# EAGLE schematic tf1230 (EAGLE 9.6.2)

## Sheet 1 of 6
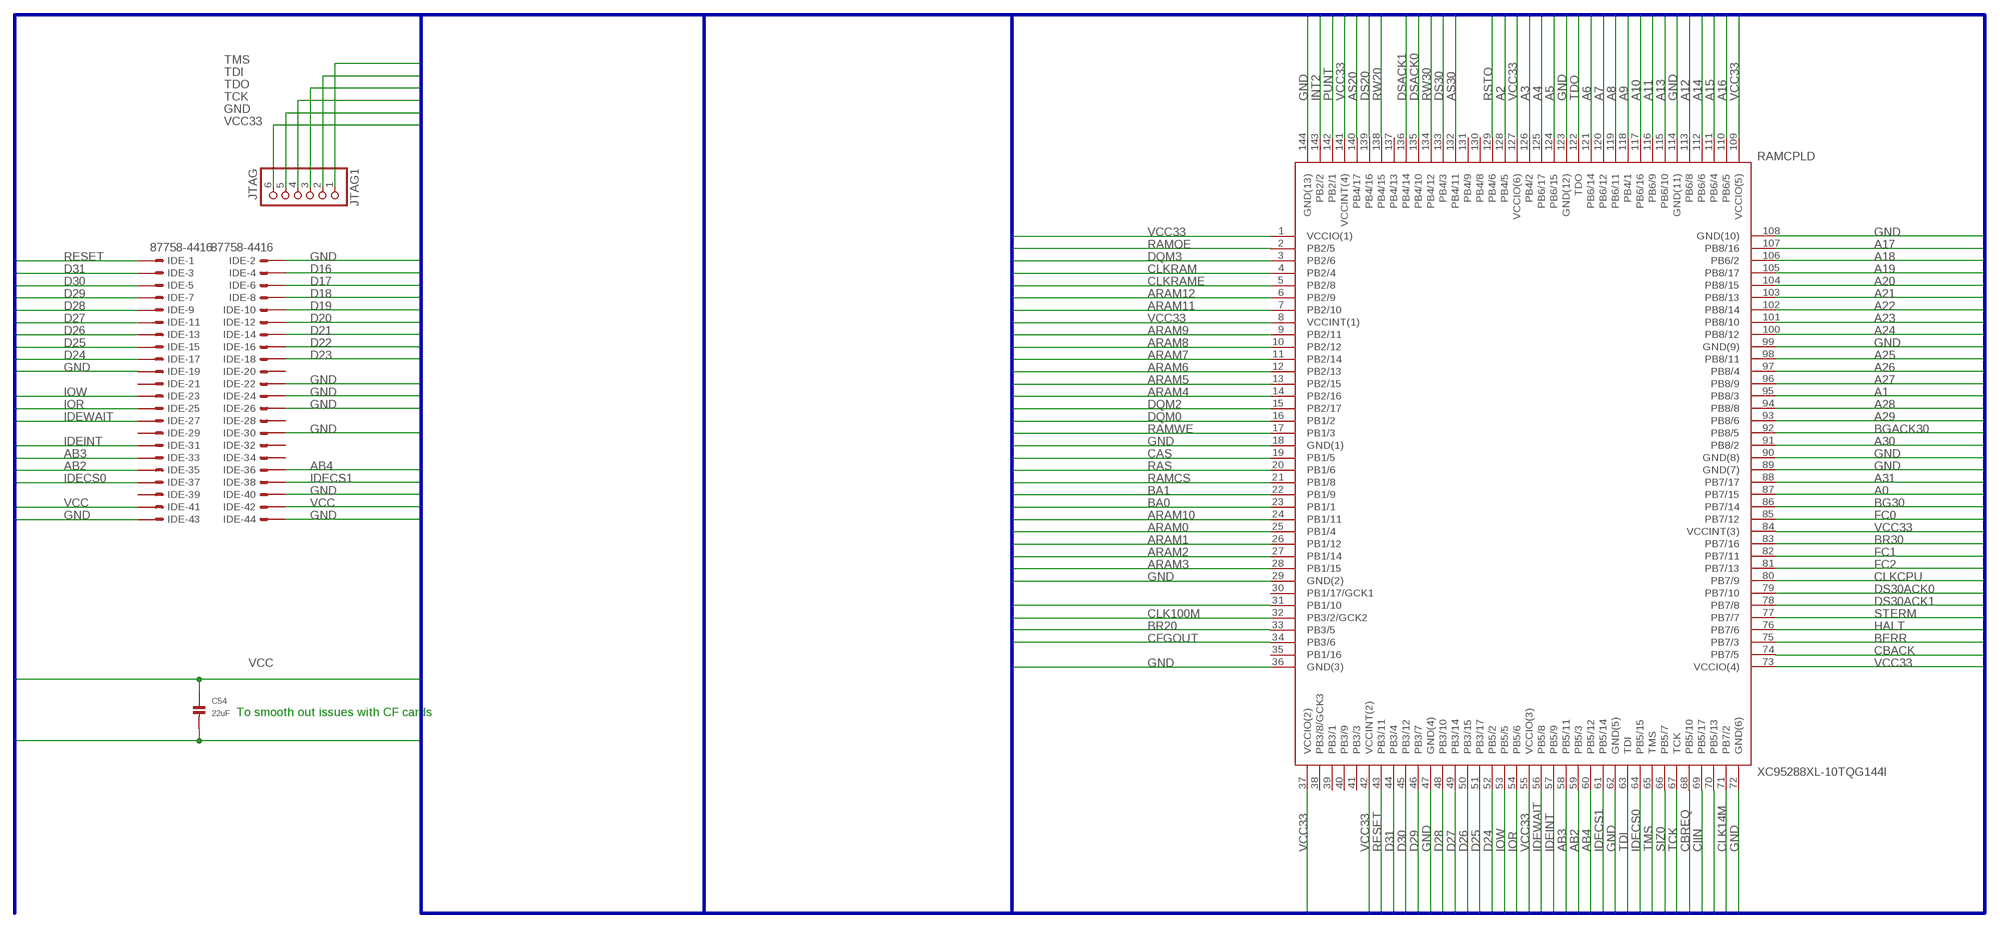
[diagram p0: schematic, sheet 1]

### Parts
C54  22uF  CAP_CERAMIC1206  [1206]
IDE  87758-4416  [87758-4416]
JTAG1  JTAG  HEADER-1X6ROUND  [1X06_ROUND]
RAMCPLD  XC95288XL-10TQG144I  SAMACSYS_PARTS_XC95144XL-10TQG144I  [SAMACSYS_PARTS_QFP50P2200X2200X160-144N]

### Nets
A0: RAMCPLD.87(PB7/15) ; also sheet 4,5
A1: RAMCPLD.95(PB8/3) ; also sheet 4,5
A2: RAMCPLD.128(PB4/5) ; also sheet 4,5
A3: RAMCPLD.126(PB4/2) ; also sheet 4,5
A4: RAMCPLD.125(PB6/17) ; also sheet 4,5
A5: RAMCPLD.124(PB6/15) ; also sheet 4,5
A6: RAMCPLD.121(PB6/14) ; also sheet 4,5
A7: RAMCPLD.120(PB6/12) ; also sheet 4,5
A8: RAMCPLD.119(PB6/11) ; also sheet 4,5
A9: RAMCPLD.118(PB4/1) ; also sheet 4,5
A10: RAMCPLD.117(PB6/16) ; also sheet 4,5
A11: RAMCPLD.116(PB6/9) ; also sheet 4,5
A12: RAMCPLD.113(PB6/8) ; also sheet 4,5
A13: RAMCPLD.115(PB6/10) ; also sheet 4,5
A14: RAMCPLD.112(PB6/6) ; also sheet 4,5
A15: RAMCPLD.111(PB6/4) ; also sheet 4,5
A16: RAMCPLD.110(PB6/5) ; also sheet 4,5
A17: RAMCPLD.107(PB8/16) ; also sheet 4,5
A18: RAMCPLD.106(PB6/2) ; also sheet 4,5
A19: RAMCPLD.105(PB8/17) ; also sheet 4,5
A20: RAMCPLD.104(PB8/15) ; also sheet 4,5
A21: RAMCPLD.103(PB8/13) ; also sheet 4,5
A22: RAMCPLD.102(PB8/14) ; also sheet 4,5
A23: RAMCPLD.101(PB8/10) ; also sheet 4,5
A24: RAMCPLD.100(PB8/12) ; also sheet 4,5
A25: RAMCPLD.98(PB8/11) ; also sheet 4,5
A26: RAMCPLD.97(PB8/4) ; also sheet 4,5
A27: RAMCPLD.96(PB8/9) ; also sheet 4,5
A28: RAMCPLD.94(PB8/8) ; also sheet 4,5
A29: RAMCPLD.93(PB8/6) ; also sheet 4,5
A30: RAMCPLD.91(PB8/2) ; also sheet 4,5
A31: RAMCPLD.88(PB7/17) ; also sheet 4,5
AB2: IDE.35 RAMCPLD.59(PB5/3)
AB3: IDE.33 RAMCPLD.58(PB5/11)
AB4: IDE.36 RAMCPLD.60(PB5/12)
ARAM0: RAMCPLD.25(PB1/4) ; also sheet 2
ARAM1: RAMCPLD.26(PB1/12) ; also sheet 2
ARAM2: RAMCPLD.27(PB1/14) ; also sheet 2
ARAM3: RAMCPLD.28(PB1/15) ; also sheet 2
ARAM4: RAMCPLD.14(PB2/16) ; also sheet 2
ARAM5: RAMCPLD.13(PB2/15) ; also sheet 2
ARAM6: RAMCPLD.12(PB2/13) ; also sheet 2
ARAM7: RAMCPLD.11(PB2/14) ; also sheet 2
ARAM8: RAMCPLD.10(PB2/12) ; also sheet 2
ARAM9: RAMCPLD.9(PB2/11) ; also sheet 2
ARAM10: RAMCPLD.24(PB1/11) ; also sheet 2
ARAM11: RAMCPLD.7(PB2/10) ; also sheet 2
ARAM12: RAMCPLD.6(PB2/9) ; also sheet 2
AS20: RAMCPLD.140(PB4/17) ; also sheet 4
AS30: RAMCPLD.132(PB4/11) ; also sheet 5
BA0: RAMCPLD.23(PB1/1) ; also sheet 2
BA1: RAMCPLD.22(PB1/9) ; also sheet 2
BERR: RAMCPLD.75(PB7/3) ; also sheet 4,5
BG30: RAMCPLD.86(PB7/14) ; also sheet 5
BGACK30: RAMCPLD.92(PB8/5) ; also sheet 5
BR20: RAMCPLD.33(PB3/5) ; also sheet 2,4,5
BR30: RAMCPLD.83(PB7/16) ; also sheet 5
CAS: RAMCPLD.19(PB1/5) ; also sheet 2
CBACK: RAMCPLD.74(PB7/5) ; also sheet 5
CBREQ: RAMCPLD.68(PB5/10) ; also sheet 5
CFGOUT: RAMCPLD.34(PB3/6) ; also sheet 4
CIIN: RAMCPLD.69(PB5/17) ; also sheet 5
CLK14M: RAMCPLD.71(PB7/2) ; also sheet 4
CLK100M: RAMCPLD.32(PB3/2/GCK2) ; also sheet 2
CLKCPU: RAMCPLD.80(PB7/9) ; also sheet 5
CLKRAM: RAMCPLD.4(PB2/4) ; also sheet 2
CLKRAME: RAMCPLD.5(PB2/8) ; also sheet 2
D16: IDE.4 ; also sheet 4,5,6
D17: IDE.6 ; also sheet 4,5,6
D18: IDE.8 ; also sheet 4,5,6
D19: IDE.10 ; also sheet 4,5,6
D20: IDE.12 ; also sheet 4,5,6
D21: IDE.14 ; also sheet 4,5,6
D22: IDE.16 ; also sheet 4,5,6
D23: IDE.18 ; also sheet 4,5,6
D24: IDE.17 RAMCPLD.52(PB5/2) ; also sheet 4,5,6
D25: IDE.15 RAMCPLD.51(PB3/17) ; also sheet 4,5,6
D26: IDE.13 RAMCPLD.50(PB3/15) ; also sheet 4,5,6
D27: IDE.11 RAMCPLD.49(PB3/14) ; also sheet 4,5,6
D28: IDE.9 RAMCPLD.48(PB3/10) ; also sheet 4,5,6
D29: IDE.7 RAMCPLD.46(PB3/7) ; also sheet 4,5,6
D30: IDE.5 RAMCPLD.45(PB3/12) ; also sheet 4,5,6
D31: IDE.3 RAMCPLD.44(PB3/4) ; also sheet 4,5,6
DQM0: RAMCPLD.16(PB1/2) ; also sheet 2
DQM1: RAMCPLD.31(PB1/10) ; also sheet 2
DQM2: RAMCPLD.15(PB2/17) ; also sheet 2
DQM3: RAMCPLD.3(PB2/6) ; also sheet 2
DS20: RAMCPLD.139(PB4/16) ; also sheet 4
DS30: RAMCPLD.133(PB4/3) ; also sheet 5
DS30ACK0: RAMCPLD.79(PB7/10) ; also sheet 5
DS30ACK1: RAMCPLD.78(PB7/8) ; also sheet 5
DSACK0: RAMCPLD.135(PB4/10) ; also sheet 4
DSACK1: RAMCPLD.136(PB4/14) ; also sheet 4
FC0: RAMCPLD.85(PB7/12) ; also sheet 4,5
FC1: RAMCPLD.82(PB7/11) ; also sheet 4,5
FC2: RAMCPLD.81(PB7/13) ; also sheet 4,5
GND: C54.2 IDE.2 IDE.19 IDE.22 IDE.24 IDE.26 IDE.30 IDE.40 IDE.43 IDE.44 JTAG1.5 RAMCPLD.18(GND(1)) RAMCPLD.29(GND(2)) RAMCPLD.36(GND(3)) RAMCPLD.47(GND(4)) RAMCPLD.62(GND(5)) RAMCPLD.72(GND(6)) RAMCPLD.89(GND(7)) RAMCPLD.90(GND(8)) RAMCPLD.99(GND(9)) RAMCPLD.108(GND(10)) RAMCPLD.114(GND(11)) RAMCPLD.123(GND(12)) RAMCPLD.144(GND(13)) ; also sheet 2,3,4,5,6
HALT: RAMCPLD.76(PB7/6) ; also sheet 5
IDECS0: IDE.37 RAMCPLD.64(PB5/15)
IDECS1: IDE.38 RAMCPLD.61(PB5/14)
IDEINT: IDE.31 RAMCPLD.57(PB5/9) ; also sheet 5
IDEWAIT: IDE.27 RAMCPLD.56(PB5/8) ; also sheet 5
INT2: RAMCPLD.143(PB2/2) ; also sheet 4
IOR: IDE.25 RAMCPLD.54(PB5/6)
IOW: IDE.23 RAMCPLD.53(PB5/5)
PUNT: RAMCPLD.142(PB2/1) ; also sheet 4
RAMCS: RAMCPLD.21(PB1/8) ; also sheet 2
RAMOE: RAMCPLD.2(PB2/5) ; also sheet 6
RAMWE: RAMCPLD.17(PB1/3) ; also sheet 2
RAS: RAMCPLD.20(PB1/6) ; also sheet 2
RESET: IDE.1 RAMCPLD.43(PB3/11) ; also sheet 4
RSTO: RAMCPLD.129(PB4/6) ; also sheet 5
RW20: RAMCPLD.138(PB4/15) ; also sheet 4
RW30: RAMCPLD.134(PB4/12) ; also sheet 5
SIZ0: RAMCPLD.66(PB5/7) ; also sheet 4,5
SIZ1: RAMCPLD.70(PB5/13) ; also sheet 4,5
STERM: RAMCPLD.77(PB7/7) ; also sheet 5
TCK: JTAG1.4 RAMCPLD.67(TCK)
TDI: JTAG1.2 RAMCPLD.63(TDI)
TDO: JTAG1.3 RAMCPLD.122(TDO)
TMS: JTAG1.1 RAMCPLD.65(TMS)
VCC: C54.1 IDE.41 IDE.42 ; also sheet 2,3,4,5
VCC33: JTAG1.6 RAMCPLD.1(VCCIO(1)) RAMCPLD.8(VCCINT(1)) RAMCPLD.37(VCCIO(2)) RAMCPLD.42(VCCINT(2)) RAMCPLD.55(VCCIO(3)) RAMCPLD.73(VCCIO(4)) RAMCPLD.84(VCCINT(3)) RAMCPLD.109(VCCIO(5)) RAMCPLD.127(VCCIO(6)) RAMCPLD.141(VCCINT(4)) ; also sheet 2,3,6
Unconnected: IDE.20 IDE.21 IDE.28 IDE.29 IDE.32 IDE.34 IDE.39 RAMCPLD.30(PB1/17/GCK1) RAMCPLD.35(PB1/16) RAMCPLD.38(PB3/8/GCK3) RAMCPLD.39(PB3/1) RAMCPLD.40(PB3/9) RAMCPLD.41(PB3/3) RAMCPLD.130(PB4/8) RAMCPLD.131(PB4/9) RAMCPLD.137(PB4/13)

### Buses
A[0..31],AA[0..31],AB[0..5],ACTIVE,AGND,AMIGA_IPL[0..2],AMIGA_RST,ARAM[0..12],AS20,AS30,AUX[0..2],AVEC,AVEC60,BA[0..1],BB60,BCLK,BERR,BG30,BG60,BGACK30,BR20,BR30,BR60,BUSEN,CAS,CBACK,CBREQ,CDIS,CFGIN,CFGOUT,CIIN,CIIOUT,CLA,CLK14M,CLK50M,CLK100M,CLK100M_ALT,CLK100M_N,CLKCPU,CLKEN,CLKRAM,CLKRAME,CLKSEL[0..2],CLKSEL_[0..2],CPUSPACE,D[0..31],DBEN,DD[0..31],DQ[0..31],DQM[0..3],DS20,DS30,DS30ACK[0..1],DSACK[0..1],E,EXP_BG,EXP_BR,FAN_ON,FAN_RPM,FC[0..2],FIRE[0..1],GND,HALT,IDECS[0..1],IDEINT,IDELED,IDEWAIT,INT2,INT6,INTCYCLE,INTSIG[0..1],IOR,IOW,IPL[0..2],LOCK,LOCKE,MMUDIS,PCLK,PUNT,RAMCS,RAMOE,RAMWE,RAS,REFILL,RESET,RESET_O,_RST,RSTO,RTC_CS,RW20,RW30,RW60,RXD,RXD_EXT,SC[0..1],SIZ[0..1],SIZ60_[0..1],SNOOP,SPARE_CS,STERM,TA,TBI,TCI,TCK,TDI,TDINT,TDO,TEA,THERM[0..1],TIP,TM[0..2],TMS,TRA,TS,TT[0..1],TXD,TXD_EXT,VCC,VCC12V,VCC33

### Notes on the sheet
- To smooth out issues with CF cards

## Sheet 2 of 6
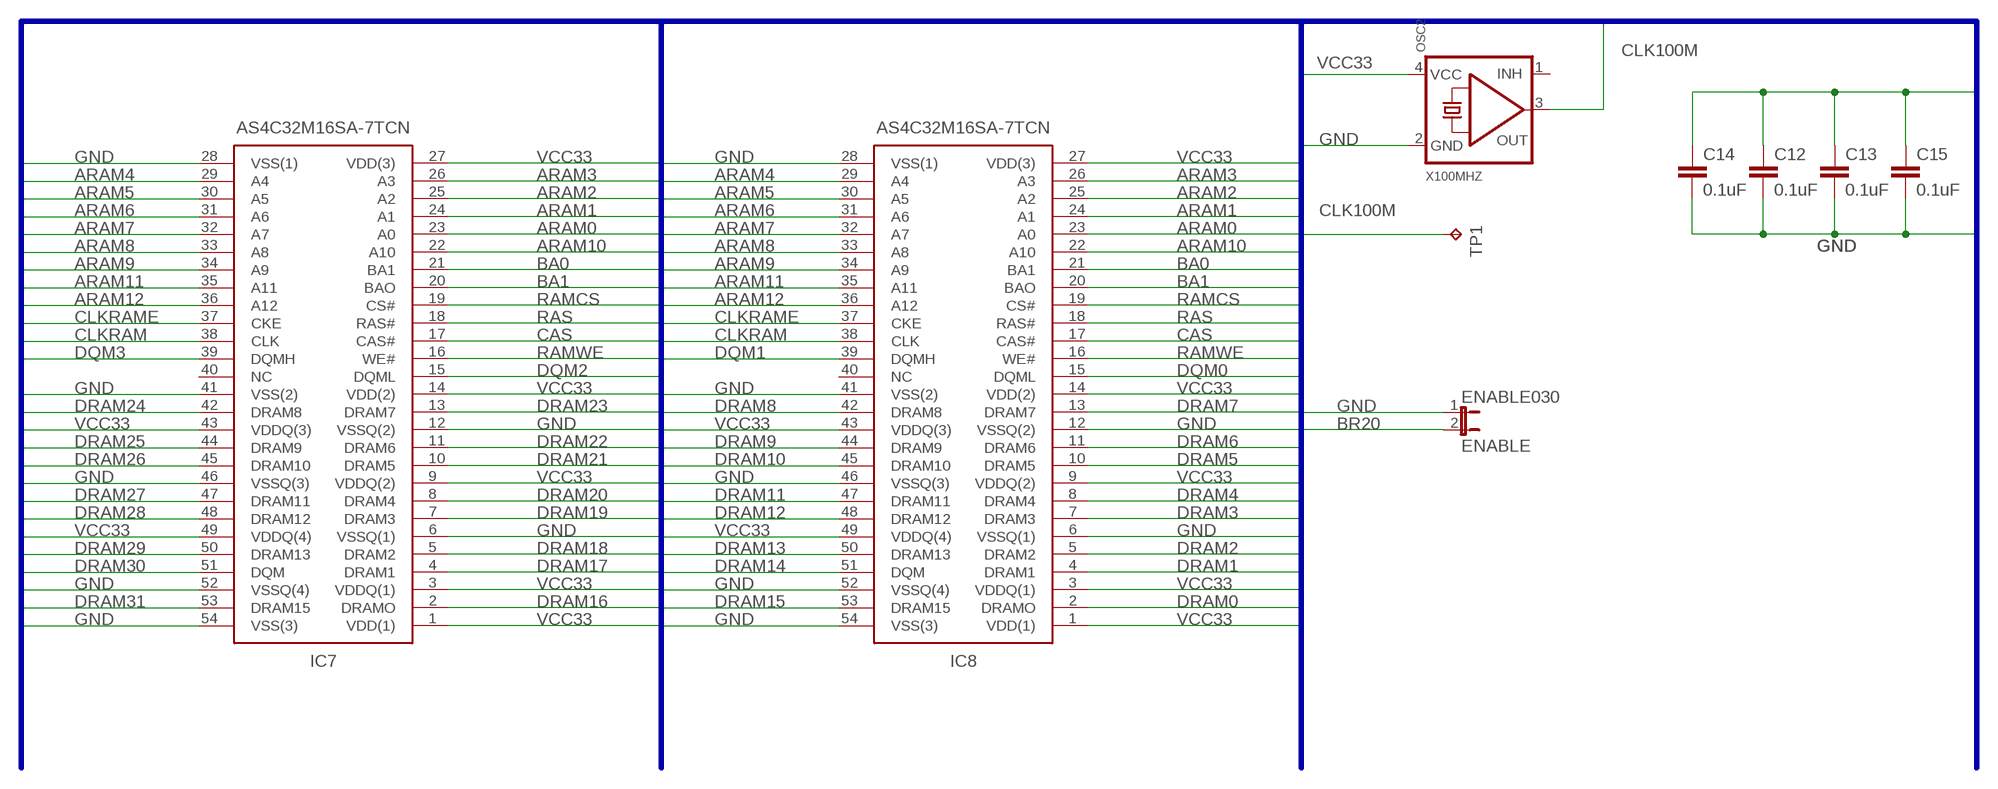
[diagram p1: schematic, sheet 2]

### Parts
C12  0.1uF  0.1UF-25V(+80/-20%)(0603)  [0603-CAP]
C13  0.1uF  0.1UF-25V(+80/-20%)(0603)  [0603-CAP]
C14  0.1uF  0.1UF-25V(+80/-20%)(0603)  [0603-CAP]
C15  0.1uF  0.1UF-25V(+80/-20%)(0603)  [0603-CAP]
ENABLE030  ENABLE  JUMPER-2PTH  [1X02]
IC7  AS4C32M16SA-7TCN  MT48LC16M16A2P-6A_G  [SOP80P1176X120-54N]
IC8  AS4C32M16SA-7TCN  MT48LC16M16A2P-6A_G  [SOP80P1176X120-54N]
OSC2  X100MHZ  OSCILLATOR  [OSC_7X5MM]
TP1  TPB1,27  [B1,27]

### Nets
ARAM0: IC7.23(A0) IC8.23(A0) ; also sheet 1
ARAM1: IC7.24(A1) IC8.24(A1) ; also sheet 1
ARAM2: IC7.25(A2) IC8.25(A2) ; also sheet 1
ARAM3: IC7.26(A3) IC8.26(A3) ; also sheet 1
ARAM4: IC7.29(A4) IC8.29(A4) ; also sheet 1
ARAM5: IC7.30(A5) IC8.30(A5) ; also sheet 1
ARAM6: IC7.31(A6) IC8.31(A6) ; also sheet 1
ARAM7: IC7.32(A7) IC8.32(A7) ; also sheet 1
ARAM8: IC7.33(A8) IC8.33(A8) ; also sheet 1
ARAM9: IC7.34(A9) IC8.34(A9) ; also sheet 1
ARAM10: IC7.22(A10) IC8.22(A10) ; also sheet 1
ARAM11: IC7.35(A11) IC8.35(A11) ; also sheet 1
ARAM12: IC7.36(A12) IC8.36(A12) ; also sheet 1
BA0: IC7.21(BA1) IC8.21(BA1) ; also sheet 1
BA1: IC7.20(BAO) IC8.20(BAO) ; also sheet 1
BR20: ENABLE030.2 ; also sheet 1,4,5
CAS: IC7.17(CAS#) IC8.17(CAS#) ; also sheet 1
CLK100M: OSC2.3(OUT) TP1.TP ; also sheet 1
CLKRAM: IC7.38(CLK) IC8.38(CLK) ; also sheet 1
CLKRAME: IC7.37(CKE) IC8.37(CKE) ; also sheet 1
DQM0: IC8.15(DQML) ; also sheet 1
DQM1: IC8.39(DQMH) ; also sheet 1
DQM2: IC7.15(DQML) ; also sheet 1
DQM3: IC7.39(DQMH) ; also sheet 1
DRAM0: IC8.2(DRAMO) ; also sheet 6
DRAM1: IC8.4(DRAM1) ; also sheet 6
DRAM2: IC8.5(DRAM2) ; also sheet 6
DRAM3: IC8.7(DRAM3) ; also sheet 6
DRAM4: IC8.8(DRAM4) ; also sheet 6
DRAM5: IC8.10(DRAM5) ; also sheet 6
DRAM6: IC8.11(DRAM6) ; also sheet 6
DRAM7: IC8.13(DRAM7) ; also sheet 6
DRAM8: IC8.42(DRAM8) ; also sheet 6
DRAM9: IC8.44(DRAM9) ; also sheet 6
DRAM10: IC8.45(DRAM10) ; also sheet 6
DRAM11: IC8.47(DRAM11) ; also sheet 6
DRAM12: IC8.48(DRAM12) ; also sheet 6
DRAM13: IC8.50(DRAM13) ; also sheet 6
DRAM14: IC8.51(DQM) ; also sheet 6
DRAM15: IC8.53(DRAM15) ; also sheet 6
DRAM16: IC7.2(DRAMO) ; also sheet 6
DRAM17: IC7.4(DRAM1) ; also sheet 6
DRAM18: IC7.5(DRAM2) ; also sheet 6
DRAM19: IC7.7(DRAM3) ; also sheet 6
DRAM20: IC7.8(DRAM4) ; also sheet 6
DRAM21: IC7.10(DRAM5) ; also sheet 6
DRAM22: IC7.11(DRAM6) ; also sheet 6
DRAM23: IC7.13(DRAM7) ; also sheet 6
DRAM24: IC7.42(DRAM8) ; also sheet 6
DRAM25: IC7.44(DRAM9) ; also sheet 6
DRAM26: IC7.45(DRAM10) ; also sheet 6
DRAM27: IC7.47(DRAM11) ; also sheet 6
DRAM28: IC7.48(DRAM12) ; also sheet 6
DRAM29: IC7.50(DRAM13) ; also sheet 6
DRAM30: IC7.51(DQM) ; also sheet 6
DRAM31: IC7.53(DRAM15) ; also sheet 6
GND: C12.2 C13.2 C14.2 C15.2 ENABLE030.1 IC7.6(VSSQ(1)) IC7.12(VSSQ(2)) IC7.28(VSS(1)) IC7.41(VSS(2)) IC7.46(VSSQ(3)) IC7.52(VSSQ(4)) IC7.54(VSS(3)) IC8.6(VSSQ(1)) IC8.12(VSSQ(2)) IC8.28(VSS(1)) IC8.41(VSS(2)) IC8.46(VSSQ(3)) IC8.52(VSSQ(4)) IC8.54(VSS(3)) OSC2.2(GND) ; also sheet 1,3,4,5,6
RAMCS: IC7.19(CS#) IC8.19(CS#) ; also sheet 1
RAMWE: IC7.16(WE#) IC8.16(WE#) ; also sheet 1
RAS: IC7.18(RAS#) IC8.18(RAS#) ; also sheet 1
VCC: C12.1 C13.1 C14.1 C15.1 ; also sheet 1,3,4,5
VCC33: IC7.1(VDD(1)) IC7.3(VDDQ(1)) IC7.9(VDDQ(2)) IC7.14(VDD(2)) IC7.27(VDD(3)) IC7.43(VDDQ(3)) IC7.49(VDDQ(4)) IC8.1(VDD(1)) IC8.3(VDDQ(1)) IC8.9(VDDQ(2)) IC8.14(VDD(2)) IC8.27(VDD(3)) IC8.43(VDDQ(3)) IC8.49(VDDQ(4)) OSC2.4(VCC) ; also sheet 1,3,6
Unconnected: IC7.40(NC) IC8.40(NC) OSC2.1(INH)

### Buses
A[0..31],AA[0..31],AB[0..5],ACTIVE,AGND,AMIGA_IPL[0..2],AMIGA_RST,ARAM[0..12],AS20,AUX[0..2],AVEC,AVEC60,BA[0..1],BB60,BCLK,BERR,BG30,BG60,BGACK20,BR30,BR60,BUSEN,CAS,CBACK,CBREQ,CDIS,CFGIN,CFGOUT,CIIN,CIIOUT,CLA,CLK14M,CLK50M,CLK100M,CLK100M_ALT,CLK100M_N,CLKCPU,CLKEN,CLKRAM,CLKRAME,CLKSEL_[0..2],CLKSEL[0..2],CPUSPACE,D[0..31],DBEN,DD[0..31],DQM[0..3],DRAM[0..31],DS20,DSACK[0..1],E,EXP_BG,EXP_BR,FAN_ON,FAN_RPM,FC[0..2],FIRE[0..1],GND,HALT,IDECS[0..1],IDEINT,IDELED,IDEWAIT,INT2,INT6,INTCYCLE,INTSIG[0..1],IOR,IOW,IPL[0..2],LOCK,LOCKE,MMUDIS,PCLK,PUNT,RAMCS,RAMOE,RAMWE,RAS,REFILL,RESET,RESET_O,_RST,RTC_CS,RW20,RW60,RXD,RXD_EXT,SC[0..1],SIZ[0..1],SIZ60_[0..1],SNOOP,SPARE_CS,TA,TBI,TCI,TCK,TDI,TDINT,TDO,TEA,THERM[0..1],TIP,TM[0..2],TMS,TRA,TS,TT[0..1],TXD,TXD_EXT,VCC,VCC12V,VCC33,BG20,BR20

## Sheet 3 of 6
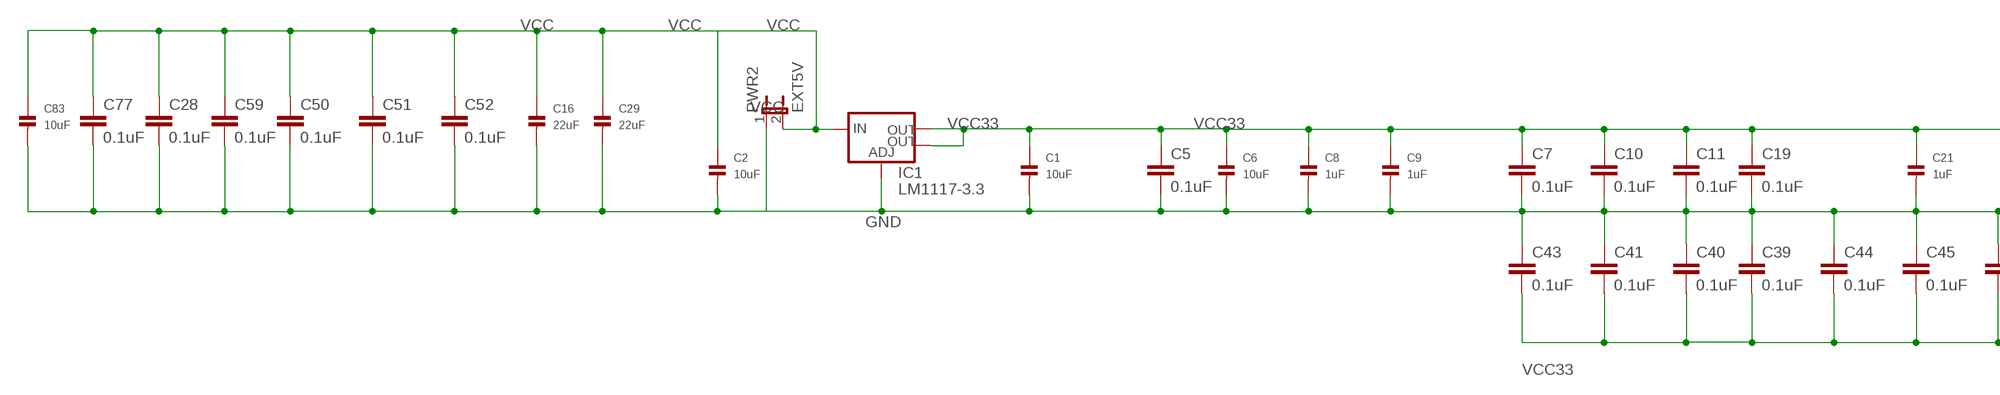
[diagram p2: schematic, sheet 3, part 1 of 2]
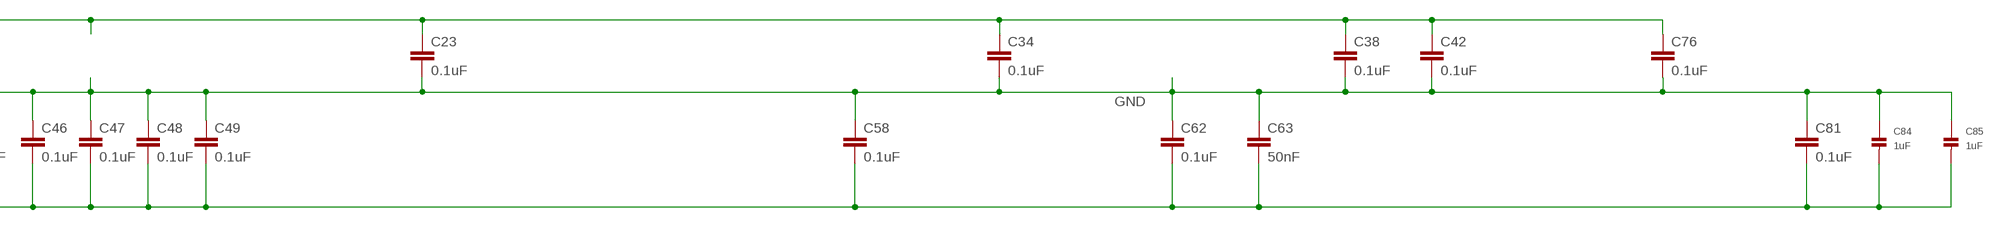
[diagram p3: schematic, sheet 3, part 2 of 2]

### Parts
C1  10uF  CAP_CERAMIC1206  [1206]
C2  10uF  CAP_CERAMIC1206  [1206]
C5  0.1uF  0.1UF-25V(+80/-20%)(0603)  [0603-CAP]
C6  10uF  CAP_CERAMIC1206  [1206]
C7  0.1uF  0.1UF-25V(+80/-20%)(0603)  [0603-CAP]
C8  1uF  CAP_CERAMIC1206  [1206]
C9  1uF  CAP_CERAMIC1206  [1206]
C10  0.1uF  0.1UF-25V(+80/-20%)(0603)  [0603-CAP]
C11  0.1uF  0.1UF-25V(+80/-20%)(0603)  [0603-CAP]
C16  22uF  CAP_CERAMIC1206  [1206]
C19  0.1uF  0.1UF-25V(+80/-20%)(0603)  [0603-CAP]
C21  1uF  CAP_CERAMIC1206  [1206]
C23  0.1uF  0.1UF-25V(+80/-20%)(0603)  [0603-CAP]
C28  0.1uF  0.1UF-25V(+80/-20%)(0603)  [0603-CAP]
C29  22uF  CAP_CERAMIC1206  [1206]
C34  0.1uF  0.1UF-25V(+80/-20%)(0603)  [0603-CAP]
C38  0.1uF  0.1UF-25V(+80/-20%)(0603)  [0603-CAP]
C39  0.1uF  0.1UF-25V(+80/-20%)(0603)  [0603-CAP]
C40  0.1uF  0.1UF-25V(+80/-20%)(0603)  [0603-CAP]
C41  0.1uF  0.1UF-25V(+80/-20%)(0603)  [0603-CAP]
C42  0.1uF  0.1UF-25V(+80/-20%)(0603)  [0603-CAP]
C43  0.1uF  0.1UF-25V(+80/-20%)(0603)  [0603-CAP]
C44  0.1uF  0.1UF-25V(+80/-20%)(0603)  [0603-CAP]
C45  0.1uF  0.1UF-25V(+80/-20%)(0603)  [0603-CAP]
C46  0.1uF  0.1UF-25V(+80/-20%)(0603)  [0603-CAP]
C47  0.1uF  0.1UF-25V(+80/-20%)(0603)  [0603-CAP]
C48  0.1uF  0.1UF-25V(+80/-20%)(0603)  [0603-CAP]
C49  0.1uF  0.1UF-25V(+80/-20%)(0603)  [0603-CAP]
C50  0.1uF  0.1UF-25V(+80/-20%)(0603)  [0603-CAP]
C51  0.1uF  0.1UF-25V(+80/-20%)(0603)  [0603-CAP]
C52  0.1uF  0.1UF-25V(+80/-20%)(0603)  [0603-CAP]
C58  0.1uF  0.1UF-25V(+80/-20%)(0603)  [0603-CAP]
C59  0.1uF  0.1UF-25V(+80/-20%)(0603)  [0603-CAP]
C62  0.1uF  0.1UF-25V(+80/-20%)(0603)  [0603-CAP]
C63  50nF  0.1UF-25V(+80/-20%)(0603)  [0603-CAP]
C76  0.1uF  0.1UF-25V(+80/-20%)(0603)  [0603-CAP]
C77  0.1uF  0.1UF-25V(+80/-20%)(0603)  [0603-CAP]
C81  0.1uF  0.1UF-25V(+80/-20%)(0603)  [0603-CAP]
C83  10uF  CAP_CERAMIC1206  [1206]
C84  1uF  CAP_CERAMIC1206  [1206]
C85  1uF  CAP_CERAMIC1206  [1206]
IC1  LM1117-3.3  V_REG_LM1117SOT223  [SOT223]
PWR2  EXT5V  JUMPER-2PTH  [1X02]

### Nets
GND: C1.2 C2.2 C5.2 C6.2 C7.2 C8.2 C9.2 C10.2 C11.2 C16.2 C19.2 C21.2 C23.2 C28.2 C29.2 C34.2 C38.2 C39.1 C40.1 C41.1 C42.2 C43.1 C44.1 C45.1 C46.1 C47.1 C48.1 C49.1 C50.2 C51.2 C52.2 C58.1 C59.2 C62.1 C63.1 C76.2 C77.2 C81.1 C83.2 C84.1 C85.1 IC1.1(ADJ) PWR2.1 ; also sheet 1,2,4,5,6
VCC: C2.1 C16.1 C28.1 C29.1 C50.1 C51.1 C52.1 C59.1 C77.1 C83.1 IC1.3(IN) PWR2.2 ; also sheet 1,2,4,5
VCC33: C1.1 C5.1 C6.1 C7.1 C8.1 C9.1 C10.1 C11.1 C19.1 C21.1 C23.1 C34.1 C38.1 C39.2 C40.2 C41.2 C42.1 C43.2 C44.2 C45.2 C46.2 C47.2 C48.2 C49.2 C58.2 C62.2 C63.2 C76.1 C81.2 C84.2 C85.2 IC1.2(OUT) IC1.4(OUT) ; also sheet 1,2,6

## Sheet 4 of 6
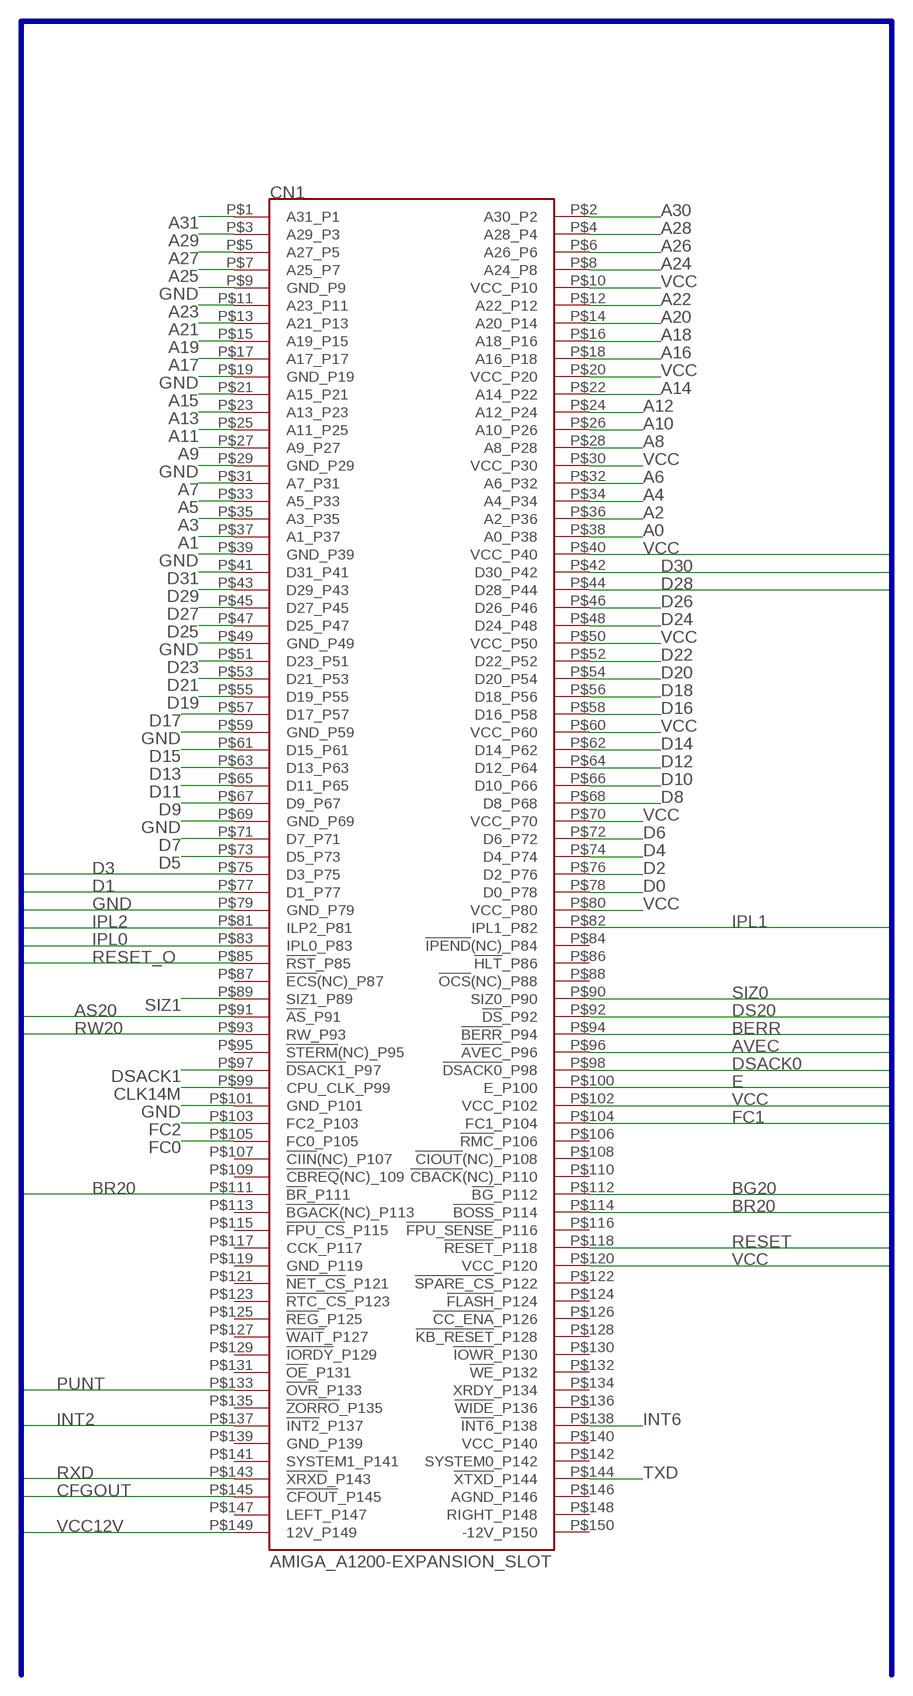
[diagram p4: schematic, sheet 4]

### Parts
CN1  AMIGA_A1200-EXPANSION_SLOT  [AMIGA_CON_150]

### Nets
A0: CN1.P$38(A0_P38) ; also sheet 1,5
A1: CN1.P$37(A1_P37) ; also sheet 1,5
A2: CN1.P$36(A2_P36) ; also sheet 1,5
A3: CN1.P$35(A3_P35) ; also sheet 1,5
A4: CN1.P$34(A4_P34) ; also sheet 1,5
A5: CN1.P$33(A5_P33) ; also sheet 1,5
A6: CN1.P$32(A6_P32) ; also sheet 1,5
A7: CN1.P$31(A7_P31) ; also sheet 1,5
A8: CN1.P$28(A8_P28) ; also sheet 1,5
A9: CN1.P$27(A9_P27) ; also sheet 1,5
A10: CN1.P$26(A10_P26) ; also sheet 1,5
A11: CN1.P$25(A11_P25) ; also sheet 1,5
A12: CN1.P$24(A12_P24) ; also sheet 1,5
A13: CN1.P$23(A13_P23) ; also sheet 1,5
A14: CN1.P$22(A14_P22) ; also sheet 1,5
A15: CN1.P$21(A15_P21) ; also sheet 1,5
A16: CN1.P$18(A16_P18) ; also sheet 1,5
A17: CN1.P$17(A17_P17) ; also sheet 1,5
A18: CN1.P$16(A18_P16) ; also sheet 1,5
A19: CN1.P$15(A19_P15) ; also sheet 1,5
A20: CN1.P$14(A20_P14) ; also sheet 1,5
A21: CN1.P$13(A21_P13) ; also sheet 1,5
A22: CN1.P$12(A22_P12) ; also sheet 1,5
A23: CN1.P$11(A23_P11) ; also sheet 1,5
A24: CN1.P$8(A24_P8) ; also sheet 1,5
A25: CN1.P$7(A25_P7) ; also sheet 1,5
A26: CN1.P$6(A26_P6) ; also sheet 1,5
A27: CN1.P$5(A27_P5) ; also sheet 1,5
A28: CN1.P$4(A28_P4) ; also sheet 1,5
A29: CN1.P$3(A29_P3) ; also sheet 1,5
A30: CN1.P$2(A30_P2) ; also sheet 1,5
A31: CN1.P$1(A31_P1) ; also sheet 1,5
AS20: CN1.P$91(!AS!_P91) ; also sheet 1
AVEC: CN1.P$96(!AVEC!_P96) ; also sheet 5
BERR: CN1.P$94(!BERR!_P94) ; also sheet 1,5
BG20: CN1.P$112(!BG!_P112)
BR20: CN1.P$111(!BR!_P111) CN1.P$114(!BOSS!_P114) ; also sheet 1,2,5
CFGOUT: CN1.P$145(!CFOUT!_P145) ; also sheet 1
CLK14M: CN1.P$99(CPU_CLK_P99) ; also sheet 1
D0: CN1.P$78(D0_P78) ; also sheet 5,6
D1: CN1.P$77(D1_P77) ; also sheet 5,6
D2: CN1.P$76(D2_P76) ; also sheet 5,6
D3: CN1.P$75(D3_P75) ; also sheet 5,6
D4: CN1.P$74(D4_P74) ; also sheet 5,6
D5: CN1.P$73(D5_P73) ; also sheet 5,6
D6: CN1.P$72(D6_P72) ; also sheet 5,6
D7: CN1.P$71(D7_P71) ; also sheet 5,6
D8: CN1.P$68(D8_P68) ; also sheet 5,6
D9: CN1.P$67(D9_P67) ; also sheet 5,6
D10: CN1.P$66(D10_P66) ; also sheet 5,6
D11: CN1.P$65(D11_P65) ; also sheet 5,6
D12: CN1.P$64(D12_P64) ; also sheet 5,6
D13: CN1.P$63(D13_P63) ; also sheet 5,6
D14: CN1.P$62(D14_P62) ; also sheet 5,6
D15: CN1.P$61(D15_P61) ; also sheet 5,6
D16: CN1.P$58(D16_P58) ; also sheet 1,5,6
D17: CN1.P$57(D17_P57) ; also sheet 1,5,6
D18: CN1.P$56(D18_P56) ; also sheet 1,5,6
D19: CN1.P$55(D19_P55) ; also sheet 1,5,6
D20: CN1.P$54(D20_P54) ; also sheet 1,5,6
D21: CN1.P$53(D21_P53) ; also sheet 1,5,6
D22: CN1.P$52(D22_P52) ; also sheet 1,5,6
D23: CN1.P$51(D23_P51) ; also sheet 1,5,6
D24: CN1.P$48(D24_P48) ; also sheet 1,5,6
D25: CN1.P$47(D25_P47) ; also sheet 1,5,6
D26: CN1.P$46(D26_P46) ; also sheet 1,5,6
D27: CN1.P$45(D27_P45) ; also sheet 1,5,6
D28: CN1.P$44(D28_P44) ; also sheet 1,5,6
D29: CN1.P$43(D29_P43) ; also sheet 1,5,6
D30: CN1.P$42(D30_P42) ; also sheet 1,5,6
D31: CN1.P$41(D31_P41) ; also sheet 1,5,6
DS20: CN1.P$92(!DS!_P92) ; also sheet 1
DSACK0: CN1.P$98(!DSACK0!_P98) ; also sheet 1
DSACK1: CN1.P$97(!DSACK1!_P97) ; also sheet 1
E: CN1.P$100(E_P100)
FC0: CN1.P$105(FC0_P105) ; also sheet 1,5
FC1: CN1.P$104(FC1_P104) ; also sheet 1,5
FC2: CN1.P$103(FC2_P103) ; also sheet 1,5
GND: CN1.P$9(GND_P9) CN1.P$19(GND_P19) CN1.P$29(GND_P29) CN1.P$39(GND_P39) CN1.P$49(GND_P49) CN1.P$59(GND_P59) CN1.P$69(GND_P69) CN1.P$79(GND_P79) CN1.P$101(GND_P101) ; also sheet 1,2,3,5,6
INT2: CN1.P$137(!INT2!_P137) ; also sheet 1
INT6: CN1.P$138(!INT6!_P138)
IPL0: CN1.P$83(IPL0_P83) ; also sheet 5
IPL1: CN1.P$82(IPL1_P82) ; also sheet 5
IPL2: CN1.P$81(ILP2_P81) ; also sheet 5
PUNT: CN1.P$133(!OVR!_P133) ; also sheet 1
RESET: CN1.P$118(!RESET!_P118) ; also sheet 1
RESET_O: CN1.P$85(!RST!_P85) ; also sheet 5
RW20: CN1.P$93(RW_P93) ; also sheet 1
RXD: CN1.P$143(!XRXD!_P143)
SIZ0: CN1.P$90(SIZ0_P90) ; also sheet 1,5
SIZ1: CN1.P$89(SIZ1_P89) ; also sheet 1,5
TXD: CN1.P$144(!XTXD!_P144)
VCC: CN1.P$10(VCC_P10) CN1.P$20(VCC_P20) CN1.P$30(VCC_P30) CN1.P$40(VCC_P40) CN1.P$50(VCC_P50) CN1.P$60(VCC_P60) CN1.P$70(VCC_P70) CN1.P$80(VCC_P80) CN1.P$102(VCC_P102) CN1.P$120(VCC_P120) ; also sheet 1,2,3,5
VCC12V: CN1.P$149(12V_P149)
Unconnected: CN1.P$84(!IPEND!(NC)_P84) CN1.P$86(!HLT!_P86) CN1.P$87(!ECS!(NC)_P87) CN1.P$88(!OCS!(NC)_P88) CN1.P$95(!STERM!(NC)_P95) CN1.P$106(!RMC!_P106) CN1.P$107(!CIIN!(NC)_P107) CN1.P$108(!CIOUT!(NC)_P108) CN1.P$109(!CBREQ!(NC)_109) CN1.P$110(!CBACK!(NC)_P110) CN1.P$113(!BGACK!(NC)_P113) CN1.P$115(!FPU_CS!_P115) CN1.P$116(!FPU_SENSE!_P116) CN1.P$117(CCK_P117) CN1.P$119(GND_P119) CN1.P$121(!NET_CS!_P121) CN1.P$122(!SPARE_CS!_P122) CN1.P$123(!RTC_CS!_P123) CN1.P$124(!FLASH!_P124) CN1.P$125(!REG!_P125) CN1.P$126(!CC_ENA!_P126) CN1.P$127(!WAIT!_P127) CN1.P$128(!KB_RESET!_P128) CN1.P$129(!IORDY!_P129) CN1.P$130(!IOWR!_P130) CN1.P$131(!OE!_P131) CN1.P$132(!WE!_P132) CN1.P$134(XRDY_P134) CN1.P$135(!ZORRO!_P135) CN1.P$136(!WIDE!_P136) CN1.P$139(GND_P139) CN1.P$140(VCC_P140) CN1.P$141(SYSTEM1_P141) CN1.P$142(SYSTEM0_P142) CN1.P$146(AGND_P146) CN1.P$147(LEFT_P147) CN1.P$148(RIGHT_P148) CN1.P$150(-12V_P150)

### Buses
A[0..31],AA[0..31],AB[0..5],ACTIVE,AGND,AMIGA_IPL[0..2],AMIGA_RST,ARAM[0..12],AS20,AS30,AUX[0..2],AVEC,AVEC60,BA[0..1],BB60,BCLK,BERR,BG30,BG60,BGACK30,BR30,BR60,BUSEN,CAS,CBACK,CBREQ,CDIS,CFGIN,CFGOUT,CIIN,CIIOUT,CLA,CLK14M,CLK50M,CLK100M,CLK100M_ALT,CLK100M_N,CLKCPU,CLKEN,CLKRAM,CLKRAME,CLKSEL[0..2],CLKSEL_[0..2],CPUSPACE,D[0..31],DBEN,DD[0..31],DQ[0..31],DQM[0..3],DS20,DS30,DSACK[0..1],E,EXP_BG,EXP_BR,FAN_ON,FAN_RPM,FC[0..2],FIRE[0..1],GND,HALT,IDECS[0..1],IDEINT,IDELED,IDEWAIT,INT2,INT6,INTCYCLE,INTSIG[0..1],IOR,IOW,IPL[0..2],LOCK,LOCKE,MMUDIS,PCLK,PUNT,RAMCS,RAMOE,RAMWE,RAS,REFILL,RESET,RESET_O,_RST,RSTO,RTC_CS,RW30,RW60,RXD,RXD_EXT,SC[0..1],SIZ[0..1],SIZ60_[0..1],SNOOP,SPARE_CS,TA,TBI,TCI,TCK,TDI,TDINT,TDO,TEA,THERM[0..1],TIP,TM[0..2],TMS,TRA,TS,TT[0..1],TXD,TXD_EXT,VCC,VCC12V,VCC33,BR20,BG20,RW20

## Sheet 5 of 6
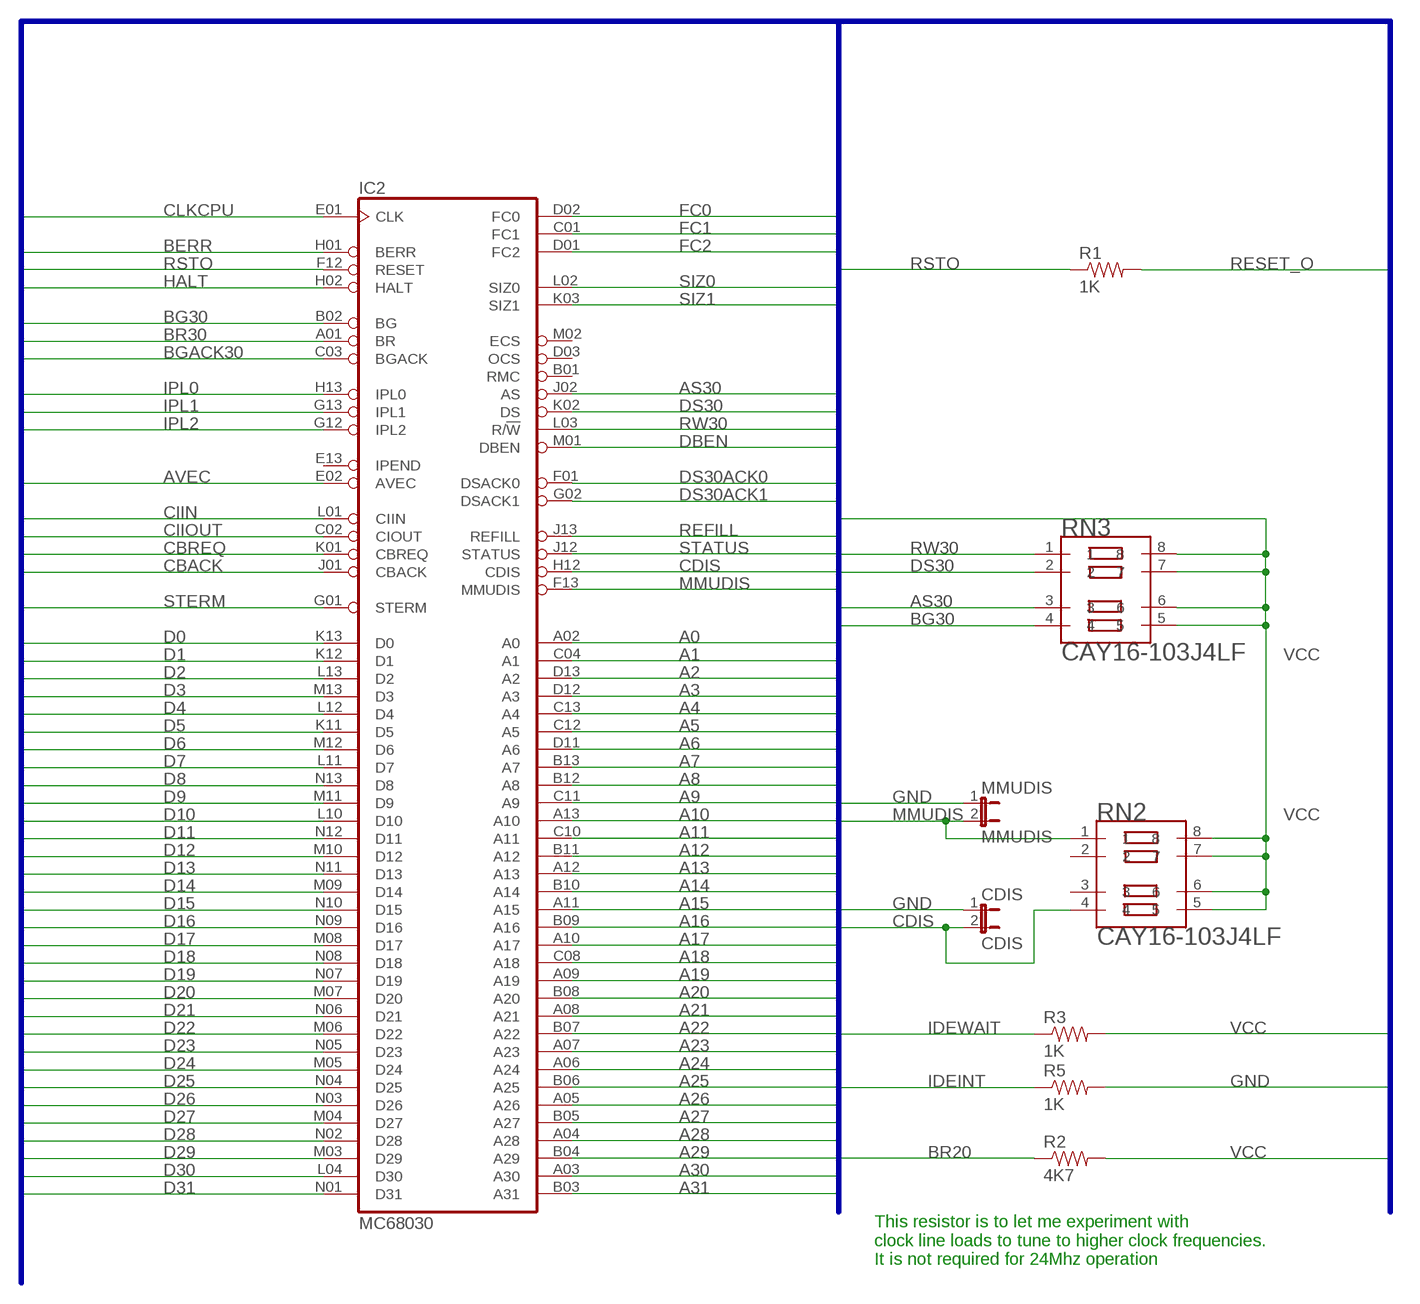
[diagram p5: schematic, sheet 5]

### Parts
CDIS  CDIS  JUMPER-2PTH  [1X02]
IC2  MC68030  MC68030RC  [MPGA128]
MMUDIS  MMUDIS  JUMPER-2PTH  [1X02]
R1  1K  0.05OHM-1/5W-1%(0603)  [0603]
R2  4K7  0.05OHM-1/5W-1%(0603)  [0603]
R3  1K  0.05OHM-1/5W-1%(0603)  [0603]
R5  1K  0.05OHM-1/5W-1%(0603)  [0603]
RN2  CAY16-103J4LF  [RESCAXE80P320X160-8N]
RN3  CAY16-103J4LF  [RESCAXE80P320X160-8N]

### Nets
A0: IC2.A02(A0) ; also sheet 1,4
A1: IC2.C04(A1) ; also sheet 1,4
A2: IC2.D13(A2) ; also sheet 1,4
A3: IC2.D12(A3) ; also sheet 1,4
A4: IC2.C13(A4) ; also sheet 1,4
A5: IC2.C12(A5) ; also sheet 1,4
A6: IC2.D11(A6) ; also sheet 1,4
A7: IC2.B13(A7) ; also sheet 1,4
A8: IC2.B12(A8) ; also sheet 1,4
A9: IC2.C11(A9) ; also sheet 1,4
A10: IC2.A13(A10) ; also sheet 1,4
A11: IC2.C10(A11) ; also sheet 1,4
A12: IC2.B11(A12) ; also sheet 1,4
A13: IC2.A12(A13) ; also sheet 1,4
A14: IC2.B10(A14) ; also sheet 1,4
A15: IC2.A11(A15) ; also sheet 1,4
A16: IC2.B09(A16) ; also sheet 1,4
A17: IC2.A10(A17) ; also sheet 1,4
A18: IC2.C08(A18) ; also sheet 1,4
A19: IC2.A09(A19) ; also sheet 1,4
A20: IC2.B08(A20) ; also sheet 1,4
A21: IC2.A08(A21) ; also sheet 1,4
A22: IC2.B07(A22) ; also sheet 1,4
A23: IC2.A07(A23) ; also sheet 1,4
A24: IC2.A06(A24) ; also sheet 1,4
A25: IC2.B06(A25) ; also sheet 1,4
A26: IC2.A05(A26) ; also sheet 1,4
A27: IC2.B05(A27) ; also sheet 1,4
A28: IC2.A04(A28) ; also sheet 1,4
A29: IC2.B04(A29) ; also sheet 1,4
A30: IC2.A03(A30) ; also sheet 1,4
A31: IC2.B03(A31) ; also sheet 1,4
AS30: IC2.J02(AS) RN3.3 ; also sheet 1
AVEC: IC2.E02(AVEC) ; also sheet 4
BERR: IC2.H01(BERR) ; also sheet 1,4
BG30: IC2.B02(BG) RN3.4 ; also sheet 1
BGACK30: IC2.C03(BGACK) ; also sheet 1
BR20: R2.1 ; also sheet 1,2,4
BR30: IC2.A01(BR) ; also sheet 1
CBACK: IC2.J01(CBACK) ; also sheet 1
CBREQ: IC2.K01(CBREQ) ; also sheet 1
CDIS: CDIS.2 IC2.H12(CDIS) RN2.4
CIIN: IC2.L01(CIIN) ; also sheet 1
CIIOUT: IC2.C02(CIOUT)
CLKCPU: IC2.E01(CLK) ; also sheet 1
D0: IC2.K13(D0) ; also sheet 4,6
D1: IC2.K12(D1) ; also sheet 4,6
D2: IC2.L13(D2) ; also sheet 4,6
D3: IC2.M13(D3) ; also sheet 4,6
D4: IC2.L12(D4) ; also sheet 4,6
D5: IC2.K11(D5) ; also sheet 4,6
D6: IC2.M12(D6) ; also sheet 4,6
D7: IC2.L11(D7) ; also sheet 4,6
D8: IC2.N13(D8) ; also sheet 4,6
D9: IC2.M11(D9) ; also sheet 4,6
D10: IC2.L10(D10) ; also sheet 4,6
D11: IC2.N12(D11) ; also sheet 4,6
D12: IC2.M10(D12) ; also sheet 4,6
D13: IC2.N11(D13) ; also sheet 4,6
D14: IC2.M09(D14) ; also sheet 4,6
D15: IC2.N10(D15) ; also sheet 4,6
D16: IC2.N09(D16) ; also sheet 1,4,6
D17: IC2.M08(D17) ; also sheet 1,4,6
D18: IC2.N08(D18) ; also sheet 1,4,6
D19: IC2.N07(D19) ; also sheet 1,4,6
D20: IC2.M07(D20) ; also sheet 1,4,6
D21: IC2.N06(D21) ; also sheet 1,4,6
D22: IC2.M06(D22) ; also sheet 1,4,6
D23: IC2.N05(D23) ; also sheet 1,4,6
D24: IC2.M05(D24) ; also sheet 1,4,6
D25: IC2.N04(D25) ; also sheet 1,4,6
D26: IC2.N03(D26) ; also sheet 1,4,6
D27: IC2.M04(D27) ; also sheet 1,4,6
D28: IC2.N02(D28) ; also sheet 1,4,6
D29: IC2.M03(D29) ; also sheet 1,4,6
D30: IC2.L04(D30) ; also sheet 1,4,6
D31: IC2.N01(D31) ; also sheet 1,4,6
DBEN: IC2.M01(DBEN)
DS30: IC2.K02(DS) RN3.2 ; also sheet 1
DS30ACK0: IC2.F01(DSACK0) ; also sheet 1
DS30ACK1: IC2.G02(DSACK1) ; also sheet 1
FC0: IC2.D02(FC0) ; also sheet 1,4
FC1: IC2.C01(FC1) ; also sheet 1,4
FC2: IC2.D01(FC2) ; also sheet 1,4
GND: CDIS.1 MMUDIS.1 R5.2 ; also sheet 1,2,3,4,6
HALT: IC2.H02(HALT) ; also sheet 1
IDEINT: R5.1 ; also sheet 1
IDEWAIT: R3.1 ; also sheet 1
IPL0: IC2.H13(IPL0) ; also sheet 4
IPL1: IC2.G13(IPL1) ; also sheet 4
IPL2: IC2.G12(IPL2) ; also sheet 4
MMUDIS: IC2.F13(MMUDIS) MMUDIS.2 RN2.1
REFILL: IC2.J13(REFILL)
RESET_O: R1.2 ; also sheet 4
RSTO: IC2.F12(RESET) R1.1 ; also sheet 1
RW30: IC2.L03(R/!W) RN3.1 ; also sheet 1
SIZ0: IC2.L02(SIZ0) ; also sheet 1,4
SIZ1: IC2.K03(SIZ1) ; also sheet 1,4
STATUS: IC2.J12(STATUS)
STERM: IC2.G01(STERM) ; also sheet 1
VCC: R2.2 R3.2 RN2.5 RN2.6 RN2.7 RN2.8 RN3.5 RN3.6 RN3.7 RN3.8 ; also sheet 1,2,3,4
Unconnected: IC2.B01(RMC) IC2.D03(OCS) IC2.E13(IPEND) IC2.M02(ECS) RN2.2 RN2.3

### Buses
A[0..31],ACTIVE,AGND,ARAM[0..12],AS20,AS30,AUX[0..2],AVEC,BA[0..1],BERR,BG30,BGACK20,BGACK30,BR20,BR30,BUSEN,CAS,CBACK,CBREQ,CDIS,CFGIN,CFGOUT,CIIN,CIIOUT,CLK14M,CLK50M,CLK100M,CLKCPU,CLKRAM,CLKRAME,D[0..31],DBEN,DQM[0..3],DRAM[0..31],DS20,DS30,DS30ACK[0..1],DSACK[0..1],EXP_BG,EXP_BR,FC[0..2],FIRE[0..1],GND,HALT,IDECS[0..1],IDEINT,IDELED,IDEWAIT,INT2,INT6,INTCYCLE,IOR,IOW,IPL[0..2],MMUDIS,PUNT,RAMCS,RAMOE,RAMWE,RAS,REFILL,RESET,RESET_O,RSTO,RW20,RW30,RXD,RXD_EXT,SIZ[0..1],SPARE,STATUS,STERM,TCK,TDI,TDO,TMS,TXD,TXD_EXT,VCC,VCC33

### Notes on the sheet
- This resistor is to let me experiment with 
  clock line loads to tune to higher clock frequencies. 
  It is not required for 24Mhz operation

## Sheet 6 of 6
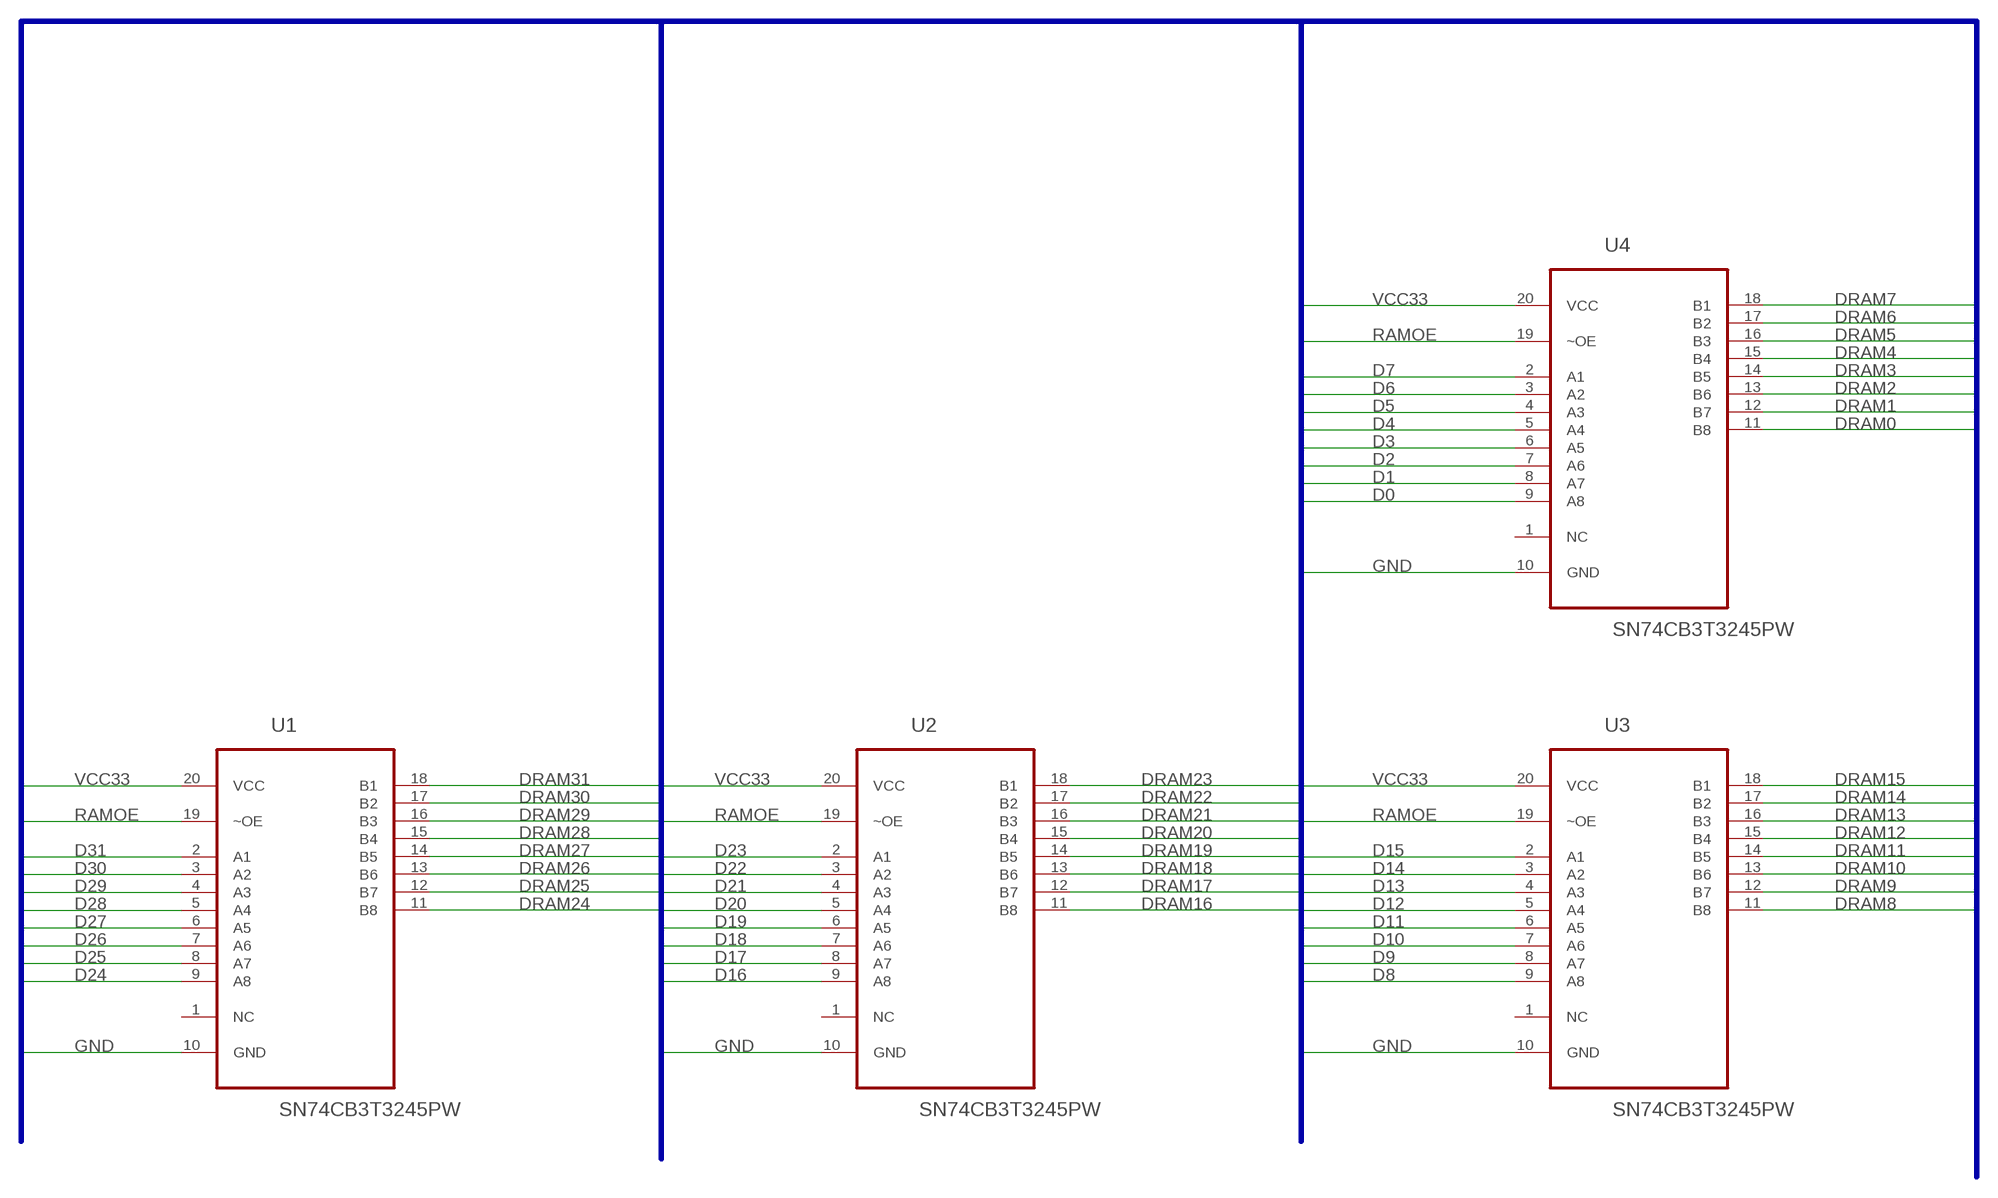
[diagram p6: schematic, sheet 6]

### Parts
U1  SN74CB3T3245PW  [SOP65P640X120-20N]
U2  SN74CB3T3245PW  [SOP65P640X120-20N]
U3  SN74CB3T3245PW  [SOP65P640X120-20N]
U4  SN74CB3T3245PW  [SOP65P640X120-20N]

### Nets
D0: U4.9(A8) ; also sheet 4,5
D1: U4.8(A7) ; also sheet 4,5
D2: U4.7(A6) ; also sheet 4,5
D3: U4.6(A5) ; also sheet 4,5
D4: U4.5(A4) ; also sheet 4,5
D5: U4.4(A3) ; also sheet 4,5
D6: U4.3(A2) ; also sheet 4,5
D7: U4.2(A1) ; also sheet 4,5
D8: U3.9(A8) ; also sheet 4,5
D9: U3.8(A7) ; also sheet 4,5
D10: U3.7(A6) ; also sheet 4,5
D11: U3.6(A5) ; also sheet 4,5
D12: U3.5(A4) ; also sheet 4,5
D13: U3.4(A3) ; also sheet 4,5
D14: U3.3(A2) ; also sheet 4,5
D15: U3.2(A1) ; also sheet 4,5
D16: U2.9(A8) ; also sheet 1,4,5
D17: U2.8(A7) ; also sheet 1,4,5
D18: U2.7(A6) ; also sheet 1,4,5
D19: U2.6(A5) ; also sheet 1,4,5
D20: U2.5(A4) ; also sheet 1,4,5
D21: U2.4(A3) ; also sheet 1,4,5
D22: U2.3(A2) ; also sheet 1,4,5
D23: U2.2(A1) ; also sheet 1,4,5
D24: U1.9(A8) ; also sheet 1,4,5
D25: U1.8(A7) ; also sheet 1,4,5
D26: U1.7(A6) ; also sheet 1,4,5
D27: U1.6(A5) ; also sheet 1,4,5
D28: U1.5(A4) ; also sheet 1,4,5
D29: U1.4(A3) ; also sheet 1,4,5
D30: U1.3(A2) ; also sheet 1,4,5
D31: U1.2(A1) ; also sheet 1,4,5
DRAM0: U4.11(B8) ; also sheet 2
DRAM1: U4.12(B7) ; also sheet 2
DRAM2: U4.13(B6) ; also sheet 2
DRAM3: U4.14(B5) ; also sheet 2
DRAM4: U4.15(B4) ; also sheet 2
DRAM5: U4.16(B3) ; also sheet 2
DRAM6: U4.17(B2) ; also sheet 2
DRAM7: U4.18(B1) ; also sheet 2
DRAM8: U3.11(B8) ; also sheet 2
DRAM9: U3.12(B7) ; also sheet 2
DRAM10: U3.13(B6) ; also sheet 2
DRAM11: U3.14(B5) ; also sheet 2
DRAM12: U3.15(B4) ; also sheet 2
DRAM13: U3.16(B3) ; also sheet 2
DRAM14: U3.17(B2) ; also sheet 2
DRAM15: U3.18(B1) ; also sheet 2
DRAM16: U2.11(B8) ; also sheet 2
DRAM17: U2.12(B7) ; also sheet 2
DRAM18: U2.13(B6) ; also sheet 2
DRAM19: U2.14(B5) ; also sheet 2
DRAM20: U2.15(B4) ; also sheet 2
DRAM21: U2.16(B3) ; also sheet 2
DRAM22: U2.17(B2) ; also sheet 2
DRAM23: U2.18(B1) ; also sheet 2
DRAM24: U1.11(B8) ; also sheet 2
DRAM25: U1.12(B7) ; also sheet 2
DRAM26: U1.13(B6) ; also sheet 2
DRAM27: U1.14(B5) ; also sheet 2
DRAM28: U1.15(B4) ; also sheet 2
DRAM29: U1.16(B3) ; also sheet 2
DRAM30: U1.17(B2) ; also sheet 2
DRAM31: U1.18(B1) ; also sheet 2
GND: U1.10(GND) U2.10(GND) U3.10(GND) U4.10(GND) ; also sheet 1,2,3,4,5
RAMOE: U1.19(~OE) U2.19(~OE) U3.19(~OE) U4.19(~OE) ; also sheet 1
VCC33: U1.20(VCC) U2.20(VCC) U3.20(VCC) U4.20(VCC) ; also sheet 1,2,3
Unconnected: U1.1(NC) U2.1(NC) U3.1(NC) U4.1(NC)

### Buses
A[0..31],ACTIVE,AGND,ARAM[0..12],AS20,AS30,AUX[0..2],AVEC,BA[0..1],BERR,BG30,BGACK20,BGACK30,BR20,BR30,BUSEN,CAS,CBACK,CBREQ,CDIS,CFGIN,CFGOUT,CIIN,CIIOUT,CLK14M,CLK50M,CLK100M,CLKCPU,CLKRAM,CLKRAME,D[0..31],DBEN,DQM[0..3],DRAM[0..31],DS20,DS30,DS30ACK[0..1],DSACK[0..1],EXP_BG,EXP_BR,FC[0..2],FIRE[0..1],GND,HALT,IDECS[0..1],IDEINT,IDELED,IDEWAIT,INT2,INT6,INTCYCLE,IOR,IOW,IPL[0..2],MMUDIS,PUNT,RAMCS,RAMOE,RAMWE,RAS,REFILL,RESET,RESET_O,RSTO,RW20,RW30,RXD,RXD_EXT,SIZ[0..1],SPARE,STATUS,STERM,TCK,TDI,TDO,TMS,TXD,TXD_EXT,VCC,VCC33

## Power pins joined to a net without a drawn wire
GND: IC2.C05(GND) IC2.C07(GND) IC2.C09(GND) IC2.E03(GND) IC2.E11(GND) IC2.F03(GND) IC2.G03(GND) IC2.G11(GND) IC2.J03(GND) IC2.J11(GND) IC2.L05(GND) IC2.L07(GND) IC2.L08(GND) IC2.L09(GND)
VCC: IC2.C06(VCC) IC2.D04(VCC) IC2.D10(VCC) IC2.F02(VCC) IC2.F11(VCC) IC2.H03(VCC) IC2.H11(VCC) IC2.K04(VCC) IC2.K10(VCC) IC2.L06(VCC)

## Library data of the parts
C1 C2 C6 C8 C9 C16 C21 C29 C54 C83-C85 = microbuilder:CAP_CERAMIC: Ceramic Capacitors 0402 - 0402 Surface Mount Capacitors 16pF 50V 5% [Digikey: 445-4899-2-ND] 18pF 50V 5% [Digikey: 490-1281-2-ND] 22pF 50V 5% [Digikey: 490-1283-2-ND] 68pF 50V 5% [Digikey: 490-1289-2-ND] 0.1uF 10V 10% [Digikey: 490-1318-2-ND] 1.0uF 6.3V 10% [Digikey: 490-1320-2-ND] 0603 - 0603 Surface Mount Capacitors 16 pF 50V 5% [Digikey: 445-5051-2-ND] 22 pF 50V [Digikey: PCC220ACVTR-ND] 33 pF 50V 5% [Digikey: 490-1415-1-ND] 56pF 50V 5% [Digikey: 490-1421-1-ND] 220pF 50V 5% [Digikey: 445-1285-1-ND] 680 pF 50V 2200 pF 50V 5% C0G [Digikey: 445-1297-1-ND] 5600 pF 100V 5% X7R [Digikey: 478-3711-1-ND] 0.1 µF 25V 10% [Digikey: PCC2277TR-ND] 0.22 µF 16V 10% X7R [Digikey: 445-1318-1-ND] 1.0 µF 25V 10% [Digikey: 445-5146-2-ND] 0603 - RF Specific 3pF 250V +/-0.1pF RF [Digikey: 712-1347-1-ND] 18 pF 250V 5% [Digikey: 478-3505-1-ND or 712-1322-1-ND] 56 pF 250V 5% C0G RF [Digikey: 490-4867-1-ND] 68 pF 250V RF [Digikey: 490-4868-1-ND] 0805 - 0805 Surface Mount Capacitors 220 pF 250V 2% RF Ceramic Capacitor [Digikey: 712-1398-1-ND] 1000 pF 50V 2% NP0 Ceramic Capacitor [Digikey: 478-3760-1-ND] 0.1 µF 25V 10% Ceramic Capacitor [Digikey: PCC1828TR-ND] 1.0 µF 16V 10% Ceramic Capacitor[Digikey: 490-1691-2-ND] 10.0 µF 10V 10% Ceramic Capacitor[Digikey: 709-1228-1-ND] 10.0 uF 16V 10% Ceramic Capacitor [Digikey: 478-5165-2-ND] 47 uF 6.3V 20% Ceramic Capacitor [Digikey: 587-1779-1-ND or 399-5506-1-ND] 1206 - 1206 Surface Mount Capacitors 47uF 10V 20% Ceramic Capacitor [Digikey: 490-5528-1-ND or 399-5508-1-ND or 445-6010-1-ND] 100uF 6.3V -20%, +80% Y5V Ceramic Capacitor (Digikey: 490-4512-1-ND, Mouser: 81-GRM31CF50J107ZE1L)
C5 C7 C10-C15 C19 C23 C28 C34 C38-C52 C58 C59 C62 C76 C77 C81 = SparkFun-Capacitors:0.1UF-25V(+80/-20%)(0603): CAP-00810 Ceramic Standard decoupling cap; PROD_ID: CAP-00810
C63 = SparkFun-Capacitors:0.1UF-25V(+80/-20%)(0603): CAP-00810 Ceramic Standard decoupling cap; PROD_ID: CAP-00810; VALUE: 0.1uF
CDIS ENABLE030 MMUDIS PWR2 = SparkFun-Retired:JUMPER-2: Jumper Basic 0.1" spaced jumper. Use with breakaway headers.
CN1 = tf1260:AMIGA_A1200-EXPANSION
IC1 = SparkFun-PowerIC:V_REG_LM1117: Voltage Regulator LM1117 Standard adjustable voltage regulator but in SMD form. Spark Fun Electronics SKU : COM-00595; PROD_ID: VREG-08170
IC2 = micro-mc68000:MC68030RC: 68xxx PROCESSOR; MF: MOTOROLA; MPN: MC68030RC50C; OC_FARNELL: unknown; OC_NEWARK: 52F3269
IC7 IC8 = SamacSys_Parts:MT48LC16M16A2P-6A_G: MT48LC16M16A2P-6A:G, SDRAM Memory 256mb Surface Mount, 3 3.6 V, 0 +70 C, 54-pin, TSOP <https://componentsearchengine.com/Images/3/MT48LC16M16A2P-6A_G.jpg> Source: Datasheet <http://www.micron.com/~/media/documents/products/data-sheet/dram/256mb_sdr.pdf>; DESCRIPTION: MT48LC16M16A2P-6A:G, SDRAM Memory 256mb Surface Mount, 3 3.6 V, 0 +70 C, 54-pin, TSOP; HEIGHT: 1.2mm; MANUFACTURER_NAME: Micron; MANUFACTURER_PART_NUMBER: MT48LC16M16A2P-6A:G; RS_PART_NUMBER: 7824553; SUPPLIER_NAME: RS
IDE = Hermes_development:87758-4416: 44 Pin - 2mm Dual Row Single Wafer, Vertical T/H HDR Source: http://www.molex.com/pdm_docs/sd/877580616_sd.pdf; MF: MOLEX; MPN: 87758-4416; OC_FARNELL: unknown; OC_NEWARK: 59J1588
JTAG1 = microbuilder:HEADER-1X6: PIN HEADER
OSC2 = microbuilder:OSCILLATOR: Oscillators 3.2x2.5mm SMT 4.0MHz +/- 50ppm, 3.3V, 9mA, -40/+85°C - Digikey: 535-9752-1-ND 50MHz +/- 50ppm, 3.3V, 8mA, -10/+70°C - Digikey: 478-4792-1-ND 5x7mm SMT 4.0MHz +/-20ppm 3.3V, 20mA, -20/+70°C - Digikey: 535-9329-2-ND 50MHz +/- 25ppm 3.3V, 35mA, -40/+85°C - Digikey: 631-1197-1-ND
R1-R3 R5 = SparkFun-Resistors:0.05OHM-1/5W-1%(0603); PROD_ID: RES-12535
RAMCPLD = sjl540:SAMACSYS_PARTS_XC95144XL-10TQG144I: XC95144XL-10TQG144I XC95144XL-10TQG144I, CPLD XC9500XL Flash 144 Cells, 117 I/O, 8 Labs, ISP, 3 3.6 V 144-Pin TQFP <https://componentsearchengine.com/Images/3/XC95144XL-10TQG144I.jpg> Source: Datasheet <http://docs-europe.electrocomponents.com/webdocs/0c77/0900766b80c77f42.pdf>; DESCRIPTION: XC95144XL-10TQG144I XC95144XL-10TQG144I, CPLD XC9500XL Flash 144 Cells, 117 I/O, 8 Labs, ISP, 3 3.6 V 144-Pin TQFP; HEIGHT: 1.6mm; MANUFACTURER_NAME: XILINX; MANUFACTURER_PART_NUMBER: XC95144XL-10TQG144I; RS_PART_NUMBER: 6260624; SUPPLIER_NAME: RS
RN2 RN3 = CAY16-103J4LF:CAY16-103J4LF: Res Thick Film Array 10K Ohm 5% 200ppm/C ISOL Molded 8-Pin 1206(4 X 0603) Convex SMD Paper T/R; AVAILABILITY: Good; DESCRIPTION: Res Thick Film Array 10K Ohm 5% ?200ppm/C ISOL Molded 8-Pin 1206(4 X 0603) Convex SMD Paper T/R; MF: Bourns; MP: CAY16-103J4LF; PACKAGE: 1206 Bourns; PRICE: 0.02 USD
TP1 = testpad:TP: Test pad
U1-U4 = SN74CB3T3245PW:SN74CB3T3245PW: 8-BIT FET BUS SWITCH; AVAILABILITY: Unavailable; DESCRIPTION: 8-Bit FET 2.5-V/3.3-V Low-Voltage Bus Switch With 5-V Tolerant Level Shifter 20-TSSOP -40 to 85; MF: Texas Instruments; MP: SN74CB3T3245PW; PACKAGE: TSSOP-20 Texas Instruments; PRICE: None

## Net classes
1 vcc: width 0.457 mm
3 gnd: width 0.254 mm